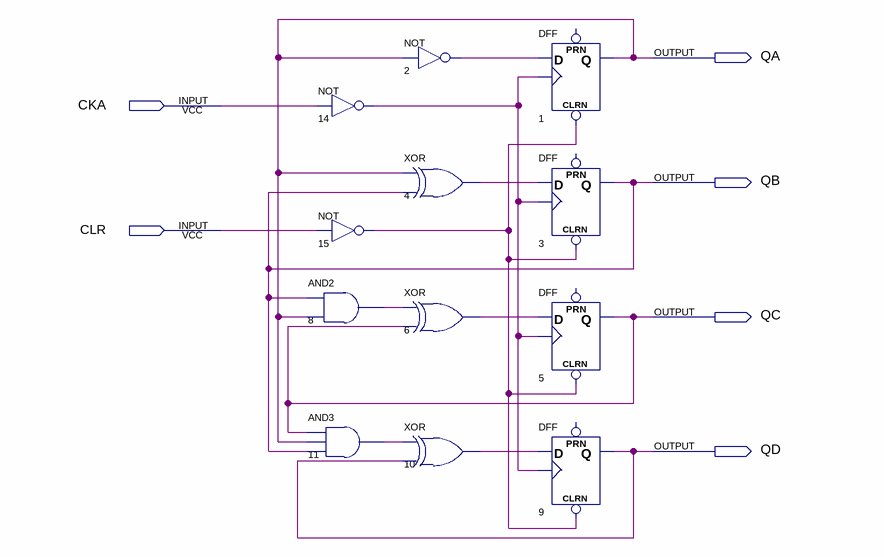
[diagram p0: schematic sheet]
// Quartus schematic 74393m.bdf as structural Verilog: 12 symbols, 6 pins
module \74393m  (
  input  CKA,
  input  CLR,
  output QA,
  output QB,
  output QC,
  output QD
);

  wire n2_out, n4_out, n6_out, n8_out, n10_out, n11_out, n14_out, n15_out;

  and u_8 (n8_out, QB, QA);
  and u_11 (n11_out, QC, QA, QB);
  not u_14 (n14_out, CKA);
  not u_15 (n15_out, CLR);
  not u_2 (n2_out, QA);
  xor u_4 (n4_out, QA, QB);
  xor u_6 (n6_out, n8_out, QC);
  xor u_10 (n10_out, n11_out, QD);
  DFF u_1 (.CLRN(n15_out), .CLK(n14_out), .D(n2_out), .Q(QA));  // open: PRN
  DFF u_3 (.CLRN(n15_out), .CLK(n14_out), .D(n4_out), .Q(QB));  // open: PRN
  DFF u_5 (.CLRN(n15_out), .CLK(n14_out), .D(n6_out), .Q(QC));  // open: PRN
  DFF u_9 (.CLRN(n15_out), .CLK(n14_out), .D(n10_out), .Q(QD));  // open: PRN
endmodule
